# Altium project GPS_Tracking_V1.3.PrjPcb
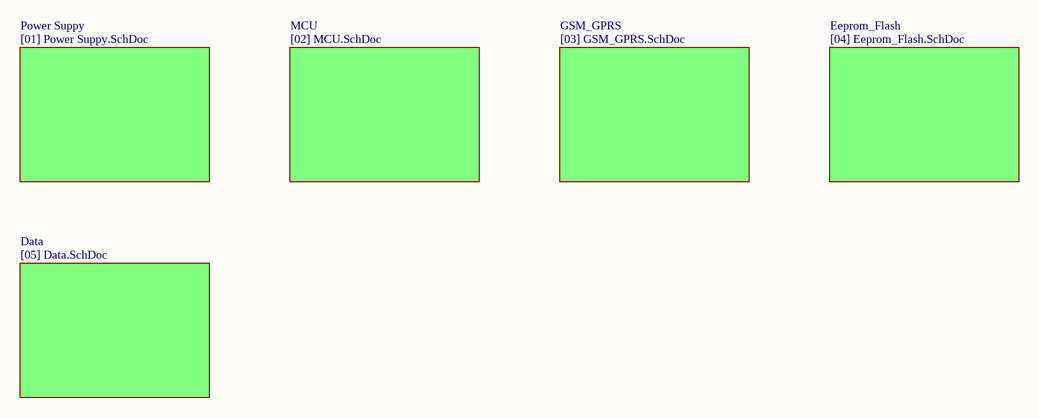
[diagram p0: GPS_Traking_V1_3.SchDoc]
6 sheets, 130 parts. Net scope: flat (ports and power ports of the same name join across sheets).
Board file: GPS_Tracking_V1_3.PcbDoc
Sheets:
  GPS_Traking_V1_3.SchDoc
    Power Suppy = [01] Power Suppy.SchDoc
    MCU = [02] MCU.SchDoc
    GSM_GPRS = [03] GSM_GPRS.SchDoc
    Eeprom_Flash = [04] Eeprom_Flash.SchDoc
    Data = [05] Data.SchDoc

## Sheet GPS_Traking_V1_3.SchDoc: GPS_Tracking
size A4

### Sub-sheets
Data = [05] Data.SchDoc: no entries
Eeprom_Flash = [04] Eeprom_Flash.SchDoc: no entries
GSM_GPRS = [03] GSM_GPRS.SchDoc: no entries
MCU = [02] MCU.SchDoc: no entries
Power Suppy = [01] Power Suppy.SchDoc: no entries

### Notes on the sheet
- Title
- Size:
- Date:
- A4
- Number:
- Time:
- Revision:
- Sheet
- of
- File:

## Sheet [01] Power Suppy.SchDoc: Power Supply
size A4
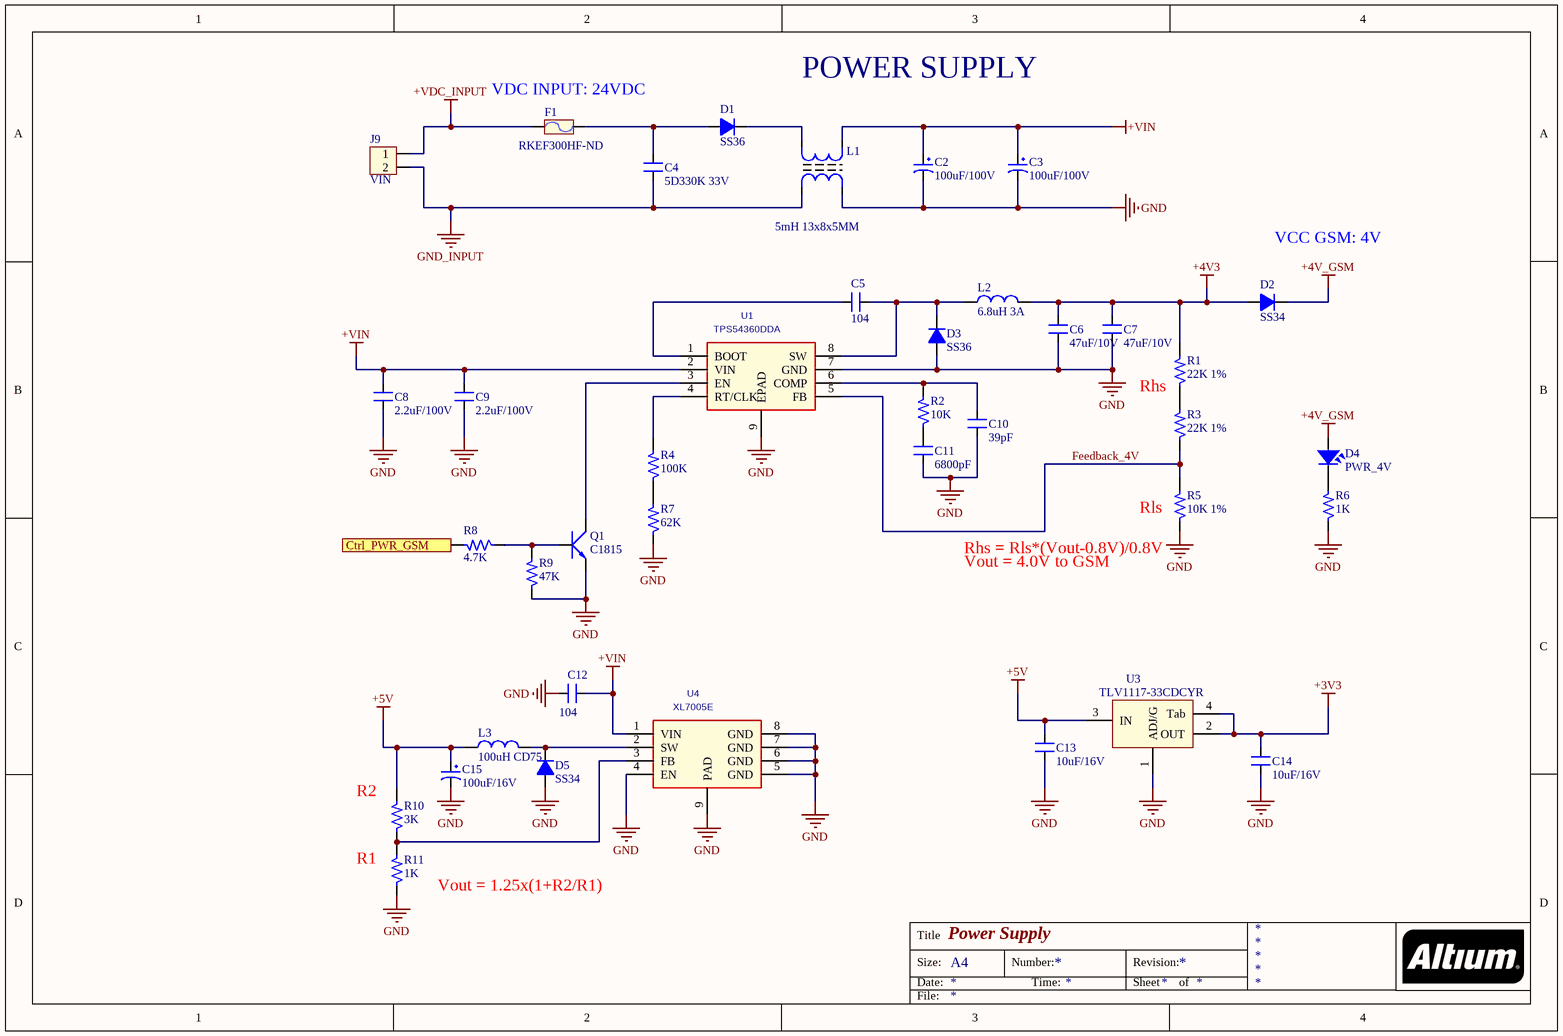
[diagram p1: [01] Power Suppy.SchDoc]

### Parts
C2  100uF/100V  [CP1.5/3.4]
C3  100uF/100V  [CP1.5/3.4]
C4  5D330K 33V  [CN2]
C5  104  [C0603 SMT]
C6  47uF/10V  [SM-1210]
C7  47uF/10V  [SM-1210]
C8  2.2uF/100V  [SM-1210]
C9  2.2uF/100V  [SM-1210]
C10  39pF  [C0603 SMT]
C11  6800pF  [C0603 SMT]
C12  104  [C0603 SMT]
C13  10uF/16V  [C0603 SMT]
C14  10uF/16V  [C0603 SMT]
C15  100uF/16V  [C_Alu_6.3x7.7]
D1  SS36  [DO-214AB SMA]
D2  SS34  [DO-214AB SMA]
D3  SS36  [DO-214AB SMA]
D4  PWR_4V  [Led_0603_Green]
D5  SS34  [DO-214AB SMA]
F1  RKEF300HF-ND  [FUSE2]
J9  VIN  [Hed2V_3.96]
L1  5mH 13x8x5MM  [L2 UF9.8]
L2  6.8uH 3A  [L01 SMD 12*12*6]
L3  100uH CD75  [L01 CD75]
Q1  C1815  [SOT23B]
R1  22K 1%  [R0603 -SMT]
R2  10K  [R0603 -SMT]
R3  22K 1%  [R0603 -SMT]
R4  100K  [R0603 -SMT]
R5  10K 1%  [R0603 -SMT]
R6  1K  [R0603 -SMT]
R7  62K  [R0603 -SMT]
R8  4.7K  [R0603 -SMT]
R9  47K  [R0603 -SMT]
R10  3K  [R0603 -SMT]
R11  1K  [R0603 -SMT]
U1  TPS54360DDA  [DDA8_3P1X2P4-M]
U3  TLV1117-33CDCYR  [SOT223-4N]
U4  XL7005E  [DDA8_3P1X2P4-M]

### Ports
Ctrl_PWR_GSM

### Nets
+3V3: C14.2 U3.2(OUT) U3.4(Tab)
+4V3: C6.2 C7.2 D2.1(A) L2.2 R1.2
+4V_GSM: D2.2(K) D4.1
+5V: C13.2 C15.1 L3.1 R10.2 U3.3(IN)
+VDC_INPUT: F1.1 J9.1
+VIN: C2.1 C3.1 C8.2 C9.2 C12.2 L1.3 U1.2(VIN) U4.1(VIN)
GND: C2.2 C3.2 C6.1 C7.1 C8.1 C9.1 C10.1 C11.1 C12.1 C13.1 C14.1 C15.2 D3.1(A) D5.1(A) L1.2 Q1.1(E) R5.1 R6.1 R7.1 R9.1 R11.1 U1.7(GND) U1.9(EPAD) U3.1(ADJ/G) U4.4(EN) U4.5(GND) U4.6(GND) U4.7(GND) U4.8(GND) U4.9(PAD)
GND_INPUT: C4.1 J9.2 L1.1
Ctrl_PWR_GSM: R8.2 ; port Ctrl_PWR_GSM
Feedback_4V: R3.1 R5.2 U1.5(FB)
NetC4_2: C4.2 D1.1(A) F1.2
NetC5_1: C5.1 U1.1(BOOT)
NetC5_2: C5.2 D3.2(K) L2.1 U1.8(SW)
NetC10_2: C10.2 R2.2 U1.6(COMP)
NetC11_2: C11.2 R2.1
NetD1_2: D1.2(K) L1.4
NetD4_2: D4.2 R6.2
NetD5_2: D5.2(K) L3.2 U4.2(SW)
NetQ1_2: Q1.2(C) U1.3(EN)
NetQ1_3: Q1.3(B) R8.1 R9.2
NetR1_1: R1.1 R3.2
NetR4_1: R4.1 R7.2
NetR4_2: R4.2 U1.4(RT/CLK)
NetR10_1: R10.1 R11.2 U4.3(FB)

### Notes on the sheet
- (near F1) VDC INPUT: 24VDC
- POWER SUPPLY
- VCC GSM: 4V
- Rhs
- (near R5) Rls
- (near R5) Rhs = Rls*(Vout-0.8V)/0.8V
- Vout = 4.0V to GSM
- (near R10) R2
- R1
- Vout = 1.25x(1+R2/R1)
- Title
- Size:
- Date:
- A4
- Number:
- Time:
- Revision:
- Sheet
- of
- File:

### Library data of the parts
C2 C3 = CP4: Cap 1000uF/16V - 220uF/50V; Description 5: 4,7uF>10uF/250V_3,3uF>10uF/400V - 2,2uF>4,7uF/450V; Description 1: 2200uF-3300uF/6,3V - 1000uF-2200uF/10V; Description 2: 1000uF/16V - 470uF => 1000uF/25V - 100uF/100V; Description 3: 330uF>470uF/35V_220uF>470uF/50V_10uF>22uF/250V; Description 4: 220uF => 330uF/63V - 10uF =>33uF/160 - 200V; Value: 1000uF/16V
C4 = CN: Value: 0,1uF/300V; Designed by: VanDungEvn
C5 C10-C14 = CM: Cap SMD; Value: 103
C6 = CM: CAP CER 47UF 10V X5R 1210; Value: 103
C7 = CM: CAP CER 47UF 10V X5R 1210 1276-3380-2-ND; Value: 103
C8 C9 = CM: CAP CER 2.2UF 100V X7R 1210  445-4498-2-ND; Value: 103
C15 = C-Alu-Tantalum: Cap Aluminum, Tantalum 7343; Value: 10uF/50V; Description 1: 10 => 220uF/6,3V/10V - 10uF => 100uF/16V; Description 2: 0,1uF => 33uF/50V - 10uF => 22uF/63V; Description 3: 0,47uF => 10uF/100V
D1 D3 = D5A: DIODE SCHOTTKY 60V 3A SMA; Value: 1N5408
D2 D5 = D1A: DIODE SCHOTTKY 40V 3A SMC; Value: 1N4007
D4 = LED: LED 0603 RED; Value: LED 3 ly Single Colour
F1 = Fuse: PTC RESET FUSE 60V 3A RADIAL; Designed by: VanDungEvn; Value: Fuse
J9 = Hed2: Header 2 (Green); Value: Header 2
L1 = L2x220: Value: Loc 220; Designed by: VanDungEvn
L2 = L1: 6.8uH 3A 12x12x7MM; Value: 150 mH
L3 = L1: Value: 150 mH
Q1 = C1815: NPN 600mW, ECB; Value: C1815
R1-R5 R7-R10 = RM: Resistor SMD; Value: 1K
R6 R11 = RM: Resistor SMD; Value: 1K
U1 = TPS54360DDA: REG BUCK SPLIT RAIL 8SOPWRPAD; C: Copyright (C) 2015 Accelerated Designs. All rights reserved; Vendor: TEXAS INSTRUMENTS; Built_By: EMA_UL_Team; Value: TPS54360DDA; Manufacturer_Part_Number: TPS54360DDA
U3 = LM1117: 3v3; Value: LM317
U4 = XL7005: REG BUCK SPLIT RAIL 8SOPWRPAD; Value: TPS54360DDA; C: Copyright (C) 2015 Accelerated Designs. All rights reserved; Vendor: TEXAS INSTRUMENTS; Built_By: EMA_UL_Team; Manufacturer_Part_Number: TPS54360DDA

## Sheet [02] MCU.SchDoc: MCU
size A4
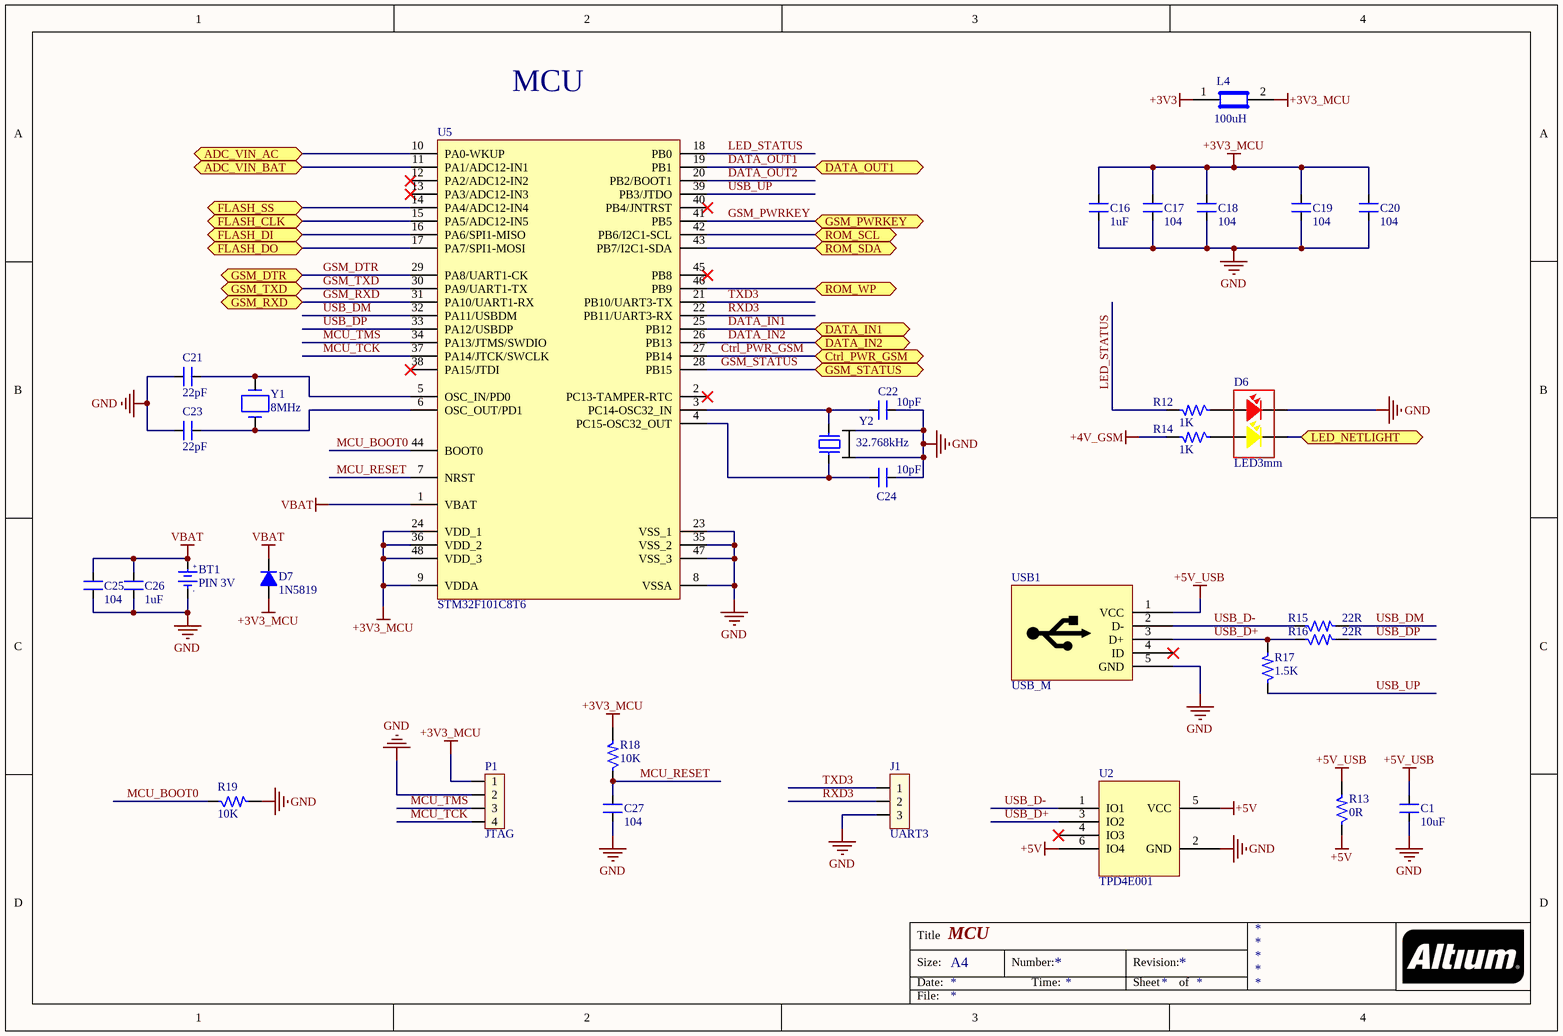
[diagram p2: [02] MCU.SchDoc]

### Parts
BT1  PIN 3V  [CR1220 socket]
C1  10uF  [C0603 SMT]
C16  1uF  [C0603 SMT]
C17  104  [C0603 SMT]
C18  104  [C0603 SMT]
C19  104  [C0603 SMT]
C20  104  [C0603 SMT]
C21  22pF  [C0603 SMT]
C22  10pF  [C0603 SMT]
C23  22pF  [C0603 SMT]
C24  10pF  [C0603 SMT]
C25  104  [C0603 SMT]
C26  1uF  [C0603 SMT]
C27  104  [C0603 SMT]
D6  LED3mm  [LED 2 holder 3mm]
D7  1N5819  [SOD123]
J1  UART3  [JP3]
L4  100uH  [R0805]
P1  JTAG  [JP1x4]
R12  1K  [R0603 -SMT]
R13  0R  [R0805 SMT]
R14  1K  [R0603 -SMT]
R15  22R  [R0603 -SMT]
R16  22R  [R0603 -SMT]
R17  1.5K  [R0603 -SMT]
R18  10K  [R0603 -SMT]
R19  10K  [R0603 -SMT]
U2  TPD4E001  [TPD4E001 DBV]
U5  STM32F101C8T6  [LQFP48-B]
USB1  USB_M  [USB_B_MINI_SMD]
Y1  8MHz  [ABM7_v1_1_BIG]
Y2  32.768kHz  [XT-SMD MC306]

### Ports
ADC_VIN_AC, ADC_VIN_BAT, Ctrl_PWR_GSM, DATA_IN1, DATA_IN2, DATA_OUT1, FLASH_CLK, FLASH_DI, FLASH_DO, FLASH_SS, GSM_DTR, GSM_PWRKEY, GSM_RXD, GSM_STATUS, GSM_TXD, LED_NETLIGHT, ROM_SCL, ROM_SDA, ROM_WP

### Nets
+3V3: L4.1
+3V3_MCU: C16.2 C17.2 C18.2 C19.2 C20.2 D7.1(A) L4.2 P1.1 R18.2 U5.9(VDDA) U5.24(VDD_1) U5.36(VDD_2) U5.48(VDD_3)
+4V_GSM: R14.2
+5V: R13.1 U2.5(VCC) U2.6(IO4)
+5V_USB: C1.2 R13.2 USB1.1(VCC)
GND: BT1.2(GND) C1.1 C16.1 C17.1 C18.1 C19.1 C20.1 C21.2 C22.2 C23.2 C24.2 C25.1 C26.1 C27.2 D6.1 J1.3 P1.2 R19.2 U2.2(GND) U5.8(VSSA) U5.23(VSS_1) U5.35(VSS_2) U5.47(VSS_3) USB1.5(GND) Y2.2 Y2.3
VBAT: BT1.1(+3V) C25.2 C26.2 D7.2(K) U5.1(VBAT)
ADC_VIN_AC: U5.10(PA0-WKUP) ; port ADC_VIN_AC
ADC_VIN_BAT: U5.11(PA1/ADC12-IN1) ; port ADC_VIN_BAT
Ctrl_PWR_GSM: U5.27(PB14) ; port Ctrl_PWR_GSM
DATA_IN1: U5.25(PB12) ; port DATA_IN1
DATA_IN2: U5.26(PB13) ; port DATA_IN2
DATA_OUT1: U5.19(PB1) ; port DATA_OUT1
DATA_OUT2: U5.20(PB2/BOOT1)
FLASH_CLK: U5.15(PA5/ADC12-IN5) ; port FLASH_CLK
FLASH_DI: U5.16(PA6/SPI1-MISO) ; port FLASH_DI
FLASH_DO: U5.17(PA7/SPI1-MOSI) ; port FLASH_DO
FLASH_SS: U5.14(PA4/ADC12-IN4) ; port FLASH_SS
GSM_DTR: U5.29(PA8/UART1-CK) ; port GSM_DTR
GSM_PWRKEY: U5.41(PB5) ; port GSM_PWRKEY
GSM_RXD: U5.31(PA10/UART1-RX) ; port GSM_RXD
GSM_STATUS: U5.28(PB15) ; port GSM_STATUS
GSM_TXD: U5.30(PA9/UART1-TX) ; port GSM_TXD
LED_STATUS: R12.2 U5.18(PB0)
MCU_BOOT0: R19.1 U5.44(BOOT0)
MCU_RESET: C27.1 R18.1 U5.7(NRST)
MCU_TCK: P1.4 U5.37(PA14/JTCK/SWCLK)
MCU_TMS: P1.3 U5.34(PA13/JTMS/SWDIO)
ROM_SCL: U5.42(PB6/I2C1-SCL) ; port ROM_SCL
ROM_SDA: U5.43(PB7/I2C1-SDA) ; port ROM_SDA
ROM_WP: U5.46(PB9) ; port ROM_WP
RXD3: J1.2 U5.22(PB11/UART3-RX)
TXD3: J1.1 U5.21(PB10/UART3-TX)
USB_D+: R16.1 R17.2 U2.3(IO2) USB1.3(D+)
USB_D-: R15.1 U2.1(IO1) USB1.2(D-)
USB_DM: R15.2 U5.32(PA11/USBDM)
USB_DP: R16.2 U5.33(PA12/USBDP)
USB_UP: R17.1 U5.39(PB3/JTDO)
NetC21_1: C21.1 U5.5(OSC_IN/PD0) Y1.1
NetC22_1: C22.1 U5.3(PC14-OSC32_IN) Y2.1
NetC23_1: C23.1 U5.6(OSC_OUT/PD1) Y1.2
NetC24_1: C24.1 U5.4(PC15-OSC32_OUT) Y2.4
NetD6_2: D6.2 R12.1
NetD6_3: D6.3 ; port LED_NETLIGHT
NetD6_4: D6.4 R14.1

Not connected (* = marked no-connect by the designer): U2 4(IO3)*; U5 2(PC13-TAMPER-RTC)* 12(PA2/ADC12-IN2)* 13(PA3/ADC12-IN3)* 38(PA15/JTDI)* 40(PB4/JNTRST)* 45(PB8)*; USB1 4(ID)*

### Notes on the sheet
- MCU
- Title
- Size:
- Date:
- A4
- Number:
- Time:
- Revision:
- Sheet
- of
- File:
- (in symbol PIN 3V) +; -

### Library data of the parts
BT1 = PIN 3V: Battery 3VDC; Value: PIN 3V
C1 C16-C27 = CM: Cap SMD; Value: 103
D6 = LED2Holder_3: LED 2 holder RGB 3mm; Value: LED 3 ly Single Colour
D7 = D1A: Diode 1A; Value: 1N4007
J1 = JP3: Jumper 3; Value: J3
L4 = Ferrite Bead: 100uH 0805
P1 = JP4
R12 R14 = RM: Resistor SMD; Value: 1K
R13 R15-R19 = RM: Resistor SMD; Value: 1K
U5 = STM32F101C8T6: STM32 ARM-based 32-bit MCU with 32 Kbytes Flash, 48-pin LQFP, Industrial Temperature
Y1 = ABM7-16.000MHZ-D2Y-T: CRYSTAL 16MHZ 18PF SMD; Manufacturer: Abracon LLC; Frequency Stability: ±30ppm; Frequency Tolerance: ±20ppm; ESR (Equivalent Series Resistance): 50 Ohm; Operating Mode: Fundamental; .Creator: MM; .Checked PCB: RF; Supplier 1: Digi-Key; Manufacturer Part Number: ABM7-16.000MHZ-D2Y-T; RoHS: RoHS Compliant; Category: Crystals and Oscillators; Stock 1: 5861; Pricing 1: 1=0.96, 10=0.847, 50=0.791, 100=0.7, 500=0.6615 (USD); Packaging: Cut Tape (CT); Type: MHz Crystal; Frequency: 16MHz; Load Capacitance: 18pF; Operating Temperature: -40°C ~ 85°C; Ratings: -; Mounting Type: Surface Mount; Package / Case: 2-SMD; Size / Dimension: 0.236" L x 0.138" W (6.00mm x 3.50mm); Height: 0.055" (1.40mm); ComponentLink1URL: http://www.abracon.com/Resonators/abm7.pdf; ComponentLink1Description: http://www.abracon.com/Resonators/abm7.pdf; Supplier Part Number 1: 535-9840-1-ND; .Checked SCH: RF
Y2 = XT4_SMD_MC306: Crystal SMD 6035 - 4 Pads; Value: 4Mhz

## Sheet [03] GSM_GPRS.SchDoc: GSM_GPRS
size A4
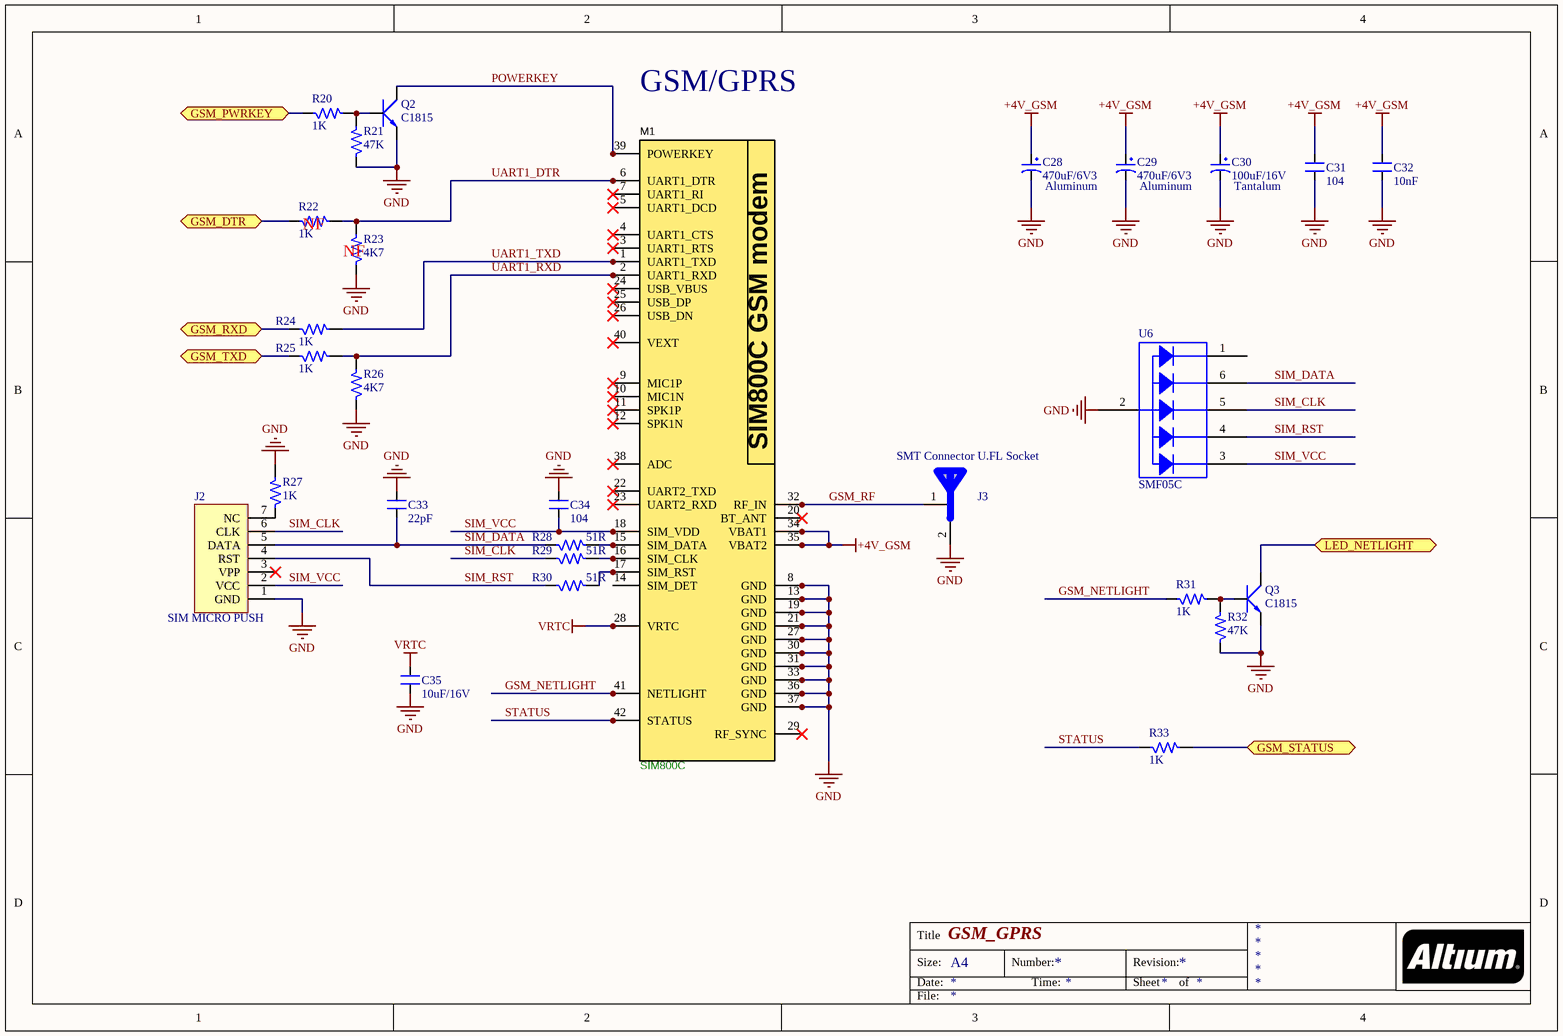
[diagram p3: [03] GSM_GPRS.SchDoc]

### Parts
C28  470uF/6V3  [C_Alu_6.3x7.7]
C29  470uF/6V3  [C_Alu_6.3x7.7]
C30  100uF/16V  [C_7343_40]
C31  104  [C0603 SMT]
C32  10nF  [C0603 SMT]
C33  22pF  [C0603 SMT]
C34  104  [C0603 SMT]
C35  10uF/16V  [C0603 SMT]
J2  SIM MICRO PUSH  [MicroSim 6P]
J3  SMT Connector U.FL Socket  [Antenna-IPEX]
M1  SIM800C  [SIM800C]
Q2  C1815  [SOT23B]
Q3  C1815  [SOT23B]
R20  1K  [R0603 -SMT]
R21  47K  [R0603 -SMT]
R22  1K  [R0603 -SMT]
R23  4K7  [R0603 -SMT]
R24  1K  [R0603 -SMT]
R25  1K  [R0603 -SMT]
R26  4K7  [R0603 -SMT]
R27  1K  [R0805 SMT]
R28  51R  [R0603 -SMT]
R29  51R  [R0603 -SMT]
R30  51R  [R0603 -SMT]
R31  1K  [R0603 -SMT]
R32  47K  [R0603 -SMT]
R33  1K  [R0603 -SMT]
U6  SMF05C  [SOT_363_6]

### Ports
GSM_DTR, GSM_PWRKEY, GSM_RXD, GSM_STATUS, GSM_TXD, LED_NETLIGHT

### Nets
+4V_GSM: C28.1 C29.1 C30.1 C31.1 C32.1 M1.34(VBAT1) M1.35(VBAT2)
GND: C28.2 C29.2 C30.2 C31.2 C32.2 C33.2 C34.2 C35.2 J2.1(GND) J3.2(GND) M1.8(GND) M1.13(GND) M1.19(GND) M1.21(GND) M1.27(GND) M1.30(GND) M1.31(GND) M1.33(GND) M1.36(GND) M1.37(GND) Q2.1(E) Q3.1(E) R21.1 R23.1 R26.1 R27.2 R32.1 U6.2(A)
VRTC: C35.1 M1.28(VRTC)
GSM_DTR: R22.1 ; port GSM_DTR
GSM_NETLIGHT: M1.41(NETLIGHT) R31.1
GSM_PWRKEY: R20.1 ; port GSM_PWRKEY
GSM_RF: J3.1(GND) M1.32(RF_IN)
GSM_RXD: R24.1 ; port GSM_RXD
GSM_STATUS: R33.2 ; port GSM_STATUS
GSM_TXD: R25.1 ; port GSM_TXD
POWERKEY: M1.39(POWERKEY) Q2.2(C)
SIM_CLK: J2.6(CLK) R29.1 U6.5(K4)
SIM_DATA: C33.1 J2.5(DATA) R28.1 U6.6(K5)
SIM_RST: J2.4(RST) R30.1 U6.4(K3)
SIM_VCC: C34.1 J2.2(VCC) M1.18(SIM_VDD) U6.3(K2)
STATUS: M1.42(STATUS) R33.1
UART1_DTR: M1.6(UART1_DTR) R22.2 R23.2
UART1_RXD: M1.2(UART1_RXD) R25.2 R26.2
UART1_TXD: M1.1(UART1_TXD) R24.2
NetD6_3: Q3.2(C) ; port LED_NETLIGHT
NetJ2_7: J2.7(NC) R27.1
NetM1_15: M1.15(SIM_DATA) R28.2
NetM1_16: M1.16(SIM_CLK) R29.2
NetM1_17: M1.17(SIM_RST) R30.2
NetQ2_3: Q2.3(B) R20.2 R21.2
NetQ3_3: Q3.3(B) R31.2 R32.2

Not connected (* = marked no-connect by the designer): J2 3(VPP)*; M1 3(UART1_RTS)* 4(UART1_CTS)* 5(UART1_DCD)* 7(UART1_RI)* 9(MIC1P)* 10(MIC1N)* 11(SPK1P)* 12(SPK1N)* 14(SIM_DET) 20(BT_ANT)* 22(UART2_TXD)* 23(UART2_RXD)* 24(USB_VBUS)* 25(USB_DP)* 26(USB_DN)* 29(RF_SYNC)* 38(ADC)* 40(VEXT)*; U6 1(K1)

### Notes on the sheet
- GSM/GPRS
- (near R22) NF
- (near C28) Aluminum
- (near C29) Aluminum
- (near C30) Tantalum
- (near R23) NF
- Title
- Size:
- Date:
- A4
- Number:
- Time:
- Revision:
- Sheet
- of
- File:
- (in symbol SIM800C) SIM800C GSM modem

### Library data of the parts
C28 C29 = C-Alu-Tantalum: Cap Aluminum; Value: 10uF/50V; Description 1: 10 => 220uF/6,3V/10V - 10uF => 100uF/16V; Description 2: 0,1uF => 33uF/50V - 10uF => 22uF/63V; Description 3: 0,47uF => 10uF/100V
C30 = C-Alu-Tantalum: Cap Tantalum 7343; Value: 10uF/50V; Description 1: 10 => 220uF/6,3V/10V - 10uF => 100uF/16V; Description 2: 0,1uF => 33uF/50V - 10uF => 22uF/63V; Description 3: 0,47uF => 10uF/100V
C31-C35 = CM: Cap SMD; Value: 103
J3 = ANTEN
Q2 Q3 = C1815: NPN 600mW, ECB; Value: C1815
R20 R22 R24 R25 R27 R31 R33 = RM: Resistor SMD; Value: 1K
R21 R23 R26 R28-R30 R32 = RM: Resistor SMD; Value: 1K
U6 = SMF05C: ESD Protection

## Sheet [04] Eeprom_Flash.SchDoc: EEPROM_FLASH
size A4
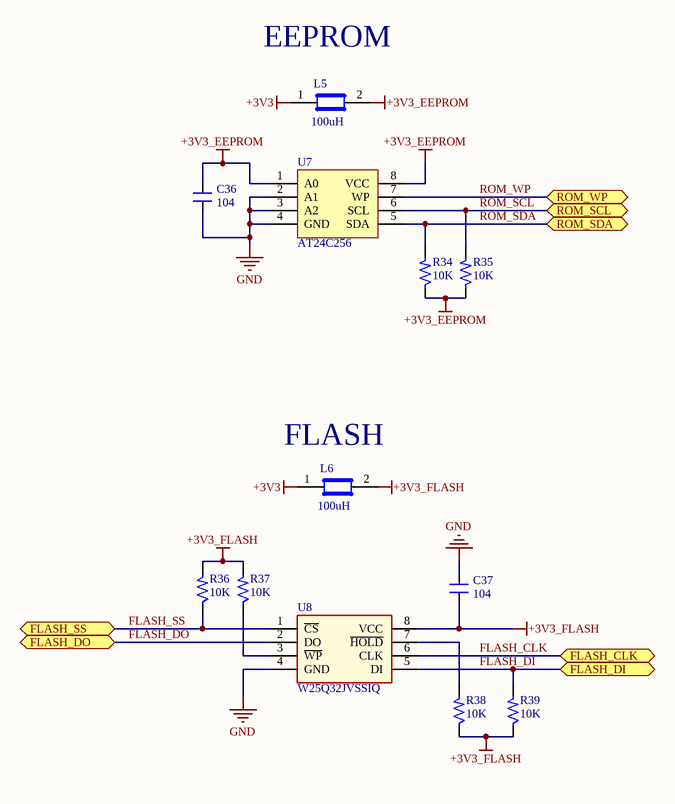
[diagram p4: [04] Eeprom_Flash.SchDoc]

### Parts
C36  104  [C0603 SMT]
C37  104  [C0603 SMT]
L5  100uH  [R0805]
L6  100uH  [R0805]
R34  10K  [R0603 -SMT]
R35  10K  [R0603 -SMT]
R36  10K  [R0603 -SMT]
R37  10K  [R0603 -SMT]
R38  10K  [R0603 -SMT]
R39  10K  [R0603 -SMT]
U7  AT24C256  [SO-8]
U8  W25Q32JVSSIQ  [SO-8 208]

### Ports
FLASH_CLK, FLASH_DI, FLASH_DO, FLASH_SS, ROM_SCL, ROM_SDA, ROM_WP

### Nets
+3V3: L5.1 L6.1
+3V3_EEPROM: C36.2 L5.2 R34.1 R35.1 U7.1(A0) U7.8(VCC)
+3V3_FLASH: C37.1 L6.2 R36.2 R37.2 R38.1 R39.1 U8.8(VCC)
GND: C36.1 C37.2 U7.2(A1) U7.3(A2) U7.4(GND) U8.4(GND)
FLASH_CLK: U8.6(CLK) ; port FLASH_CLK
FLASH_DI: R39.2 U8.5(DI) ; port FLASH_DI
FLASH_DO: U8.2(DO) ; port FLASH_DO
FLASH_SS: R36.1 U8.1(~{CS}) ; port FLASH_SS
ROM_SCL: R35.2 U7.6(SCL) ; port ROM_SCL
ROM_SDA: R34.2 U7.5(SDA) ; port ROM_SDA
ROM_WP: U7.7(WP) ; port ROM_WP
NetR37_1: R37.1 U8.3(~{WP})
NetR38_2: R38.2 U8.7(~{HOLD})

### Notes on the sheet
- (near L5) EEPROM
- (near L6) FLASH
- Title
- Size:
- Date:
- A4
- Number:
- Time:
- Revision:
- Sheet
- of
- File:

### Library data of the parts
C36 C37 = CM: Cap SMD; Value: 103
L5 L6 = Ferrite Bead: 100uH 0805
R34-R39 = RM: Resistor SMD; Value: 1K
U7 = AT24Cxx
U8 = W25Q32JV: FLASH 32MBIT 133MHZ 8SOP

## Sheet [05] Data.SchDoc: DATA
size A4
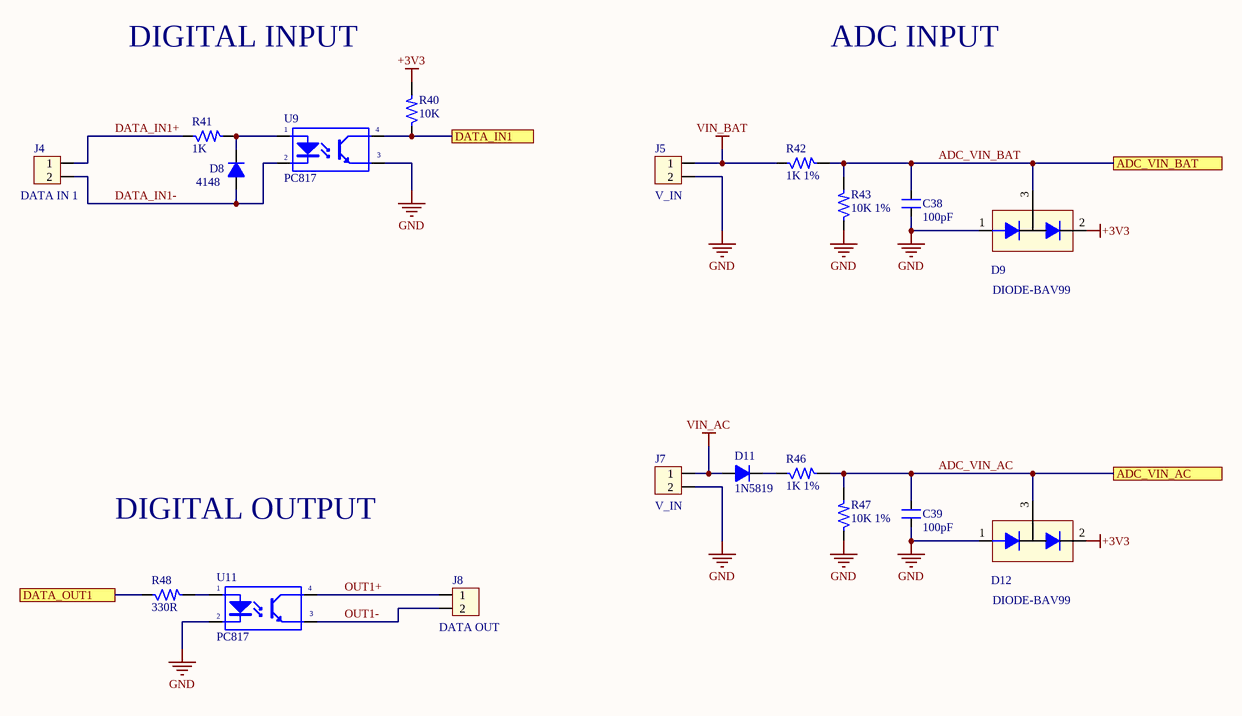
[diagram p5: [05] Data.SchDoc]

### Parts
C38  100pF  [C0603 SMT]
C39  100pF  [C0603 SMT]
D8  4148  [DO-4148 SMD]
D9  DIODE-BAV99  [SOT23]
D11  1N5819  [SOD123]
D12  DIODE-BAV99  [SOT23]
J4  DATA IN 1  [CON_2.54mm_2]
J5  V_IN  [CON_2.54mm_2]
J7  V_IN  [CON_2.54mm_2]
J8  DATA OUT  [CON_2.54mm_2]
R40  10K  [R0603 -SMT]
R41  1K  [R0603 -SMT]
R42  1K 1%  [R0603 -SMT]
R43  10K 1%  [R0603 -SMT]
R46  1K 1%  [R0603 -SMT]
R47  10K 1%  [R0603 -SMT]
R48  330R  [R0603 -SMT]
U9  PC817  [SOP-4-B]
U11  PC817  [SOP-4-B]

### Ports
ADC_VIN_AC, ADC_VIN_BAT, DATA_IN1, DATA_OUT1

### Nets
+3V3: D9.2 D12.2 R40.2
GND: C38.1 C39.1 D9.1 D12.1 J5.2 J7.2 R43.1 R47.1 U9.3(E) U11.2(K)
VIN_AC: D11.1(A) J7.1
VIN_BAT: J5.1 R42.1
ADC_VIN_AC: C39.2 D12.3 R46.2 R47.2 ; port ADC_VIN_AC
ADC_VIN_BAT: C38.2 D9.3 R42.2 R43.2 ; port ADC_VIN_BAT
DATA_IN1: R40.1 U9.4(C) ; port DATA_IN1
DATA_IN1+: J4.1 R41.1
DATA_IN1-: D8.1(A) J4.2 U9.2(K)
DATA_OUT1: R48.1 ; port DATA_OUT1
OUT1+: J8.1 U11.4(C)
OUT1-: J8.2 U11.3(E)
NetD8_2: D8.2(K) R41.2 U9.1(A)
NetD11_2: D11.2(K) R46.1
NetR48_2: R48.2 U11.1(A)

### Notes on the sheet
- DIGITAL INPUT
- ADC INPUT
- DIGITAL OUTPUT
- Title
- Size:
- Date:
- A4
- Number:
- Time:
- Revision:
- Sheet
- of
- File:

### Library data of the parts
C38 C39 = CM: Cap SMD; Value: 103
D8 D11 = D1A: Diode 1A; Value: 1N4007
D9 D12 = DIODE-BAV99: ZENER, SOT23,; Manufacturer: ON Semiconductor / Fairchild; Manufacturer Part Number: BAV99; .Creator: LeKhaLinh; Other Drawings: Diode Circuit; PCN Design/Specification: Mold Compound 12/Dec/2007; PCN Assembly/Origin: SOT23 Manufacturing Source 31/May2013 / Assembly Site Addition 20/Jul/2015; PCN Packaging: Binary Year Code Marking 15/Jan/2014; Diode Configuration: 1 Pair Series Connection; Diode Type: Standard; Voltage - DC Reverse (Vr) (Max): 70V; Current - Average Rectified (Io) (per Diode): 200mA; Voltage - Forward (Vf) (Max) @ If: 1.25V @ 150mA; Speed: Small Signal =; Reverse Recovery Time (trr): 6ns; Current - Reverse Leakage @ Vr: 2.5µA @ 70V; Online Catalog: Diode Array; Other Names: BAV99FSDKR; .CheckPCB: LeKhaLinh; .CheckSCH: LeKhaLinh; Supplier 1: Digi-Key; Stock 1: 1165; Pricing 1: 1=0.26, 10=0.21, 100=0.1115, 500=0.0734, 1000=0.0499 (USD); Standard Package: 1; Category: Discrete Semiconductor Products; Family: Diodes, Rectifiers - Arrays; Packaging: Digi-Reel®; Mounting Type: Surface Mount; Package / Case: TO-236-3, SC-59, SOT-23-3; Supplier Device Package: SOT-23-3 (TO-236); ComponentLink1URL: https://www.fairchildsemi.com/package-drawings/MA/MA03B.pdf?src-supplier=Digi-Key; ComponentLink1Description: https://www.fairchildsemi.com/package-drawings/MA/MA03B.pdf?src-supplier=Digi-Key; ComponentLink2URL: http://www.farnell.com/datasheets/1822674.pdf?src-supplier=Element14; ComponentLink2Description: http://www.farnell.com/datasheets/1822674.pdf?src-supplier=Element14; ComponentLink3URL: http://www.mouser.com/ds/2/149/BAV99-22788.pdf?src-supplier=Mouser; ComponentLink3Description: http://www.mouser.com/ds/2/149/BAV99-22788.pdf?src-supplier=Mouser; ComponentLink4URL: http://www.fairchildsemi.com/ds/BA/BAV99.pdf?src-supplier=Avnet+Europe; ComponentLink4Description: http://www.fairchildsemi.com/ds/BA/BAV99.pdf?src-supplier=Avnet+Europe; ComponentLink5URL: https://www.verical.com/server-webapp/html/getDatasheet?partID=110217&src-supplier=Verical; ComponentLink5Description: https://www.verical.com/server-webapp/html/getDatasheet?partID=110217&src-supplier=Verical; ComponentLink6URL: http://www.farnell.com/datasheets/2304409.pdf?src-supplier=Element14; ComponentLink6Description: http://www.farnell.com/datasheets/2304409.pdf?src-supplier=Element14; Supplier 2: Mouser; Stock 2: 0; Supplier 3: Arrow; Stock 3: 5700; Pricing 3: 1=0.1933, 10=0.1873, 25=0.1555, 100=0.0806, 250=0.0724, 500=0.0523, 1000=0.0428, 3000=0.0342 (USD); Supplier Part Number 1: BAV99FSCT-ND; Supplier Part Number 2: 512-BAV99; Supplier Part Number 3: BAV99
J4 J5 J7 J8 = Con2: Connector 2; Value: Connector 2
R40 R43 R47 R48 = RM: Resistor SMD; Value: 1K
R41 R42 R46 = RM: Resistor SMD; Value: 1K
U9 U11 = PC817: Single Opto; Value: PC817

## Nets that join several sheets
+3V3: [01] Power Suppy (C14.2 U3.2 U3.4), [02] MCU (L4.1), [04] Eeprom_Flash (L5.1 L6.1), [05] Data (D9.2 D12.2 R40.2)
+4V_GSM: [01] Power Suppy (D2.2 D4.1), [02] MCU (R14.2), [03] GSM_GPRS (7 pins)
+5V: [01] Power Suppy (5 pins), [02] MCU (R13.1 U2.5 U2.6)
GND: [01] Power Suppy (30 pins), [02] MCU (26 pins), [03] GSM_GPRS (28 pins), [04] Eeprom_Flash (6 pins), [05] Data (10 pins)
ADC_VIN_AC: [02] MCU (U5.10), [05] Data (C39.2 D12.3 R46.2 R47.2)
ADC_VIN_BAT: [02] MCU (U5.11), [05] Data (C38.2 D9.3 R42.2 R43.2)
Ctrl_PWR_GSM: [01] Power Suppy (R8.2), [02] MCU (U5.27)
DATA_IN1: [02] MCU (U5.25), [05] Data (R40.1 U9.4)
DATA_OUT1: [02] MCU (U5.19), [05] Data (R48.1)
FLASH_CLK: [02] MCU (U5.15), [04] Eeprom_Flash (U8.6)
FLASH_DI: [02] MCU (U5.16), [04] Eeprom_Flash (R39.2 U8.5)
FLASH_DO: [02] MCU (U5.17), [04] Eeprom_Flash (U8.2)
FLASH_SS: [02] MCU (U5.14), [04] Eeprom_Flash (R36.1 U8.1)
GSM_DTR: [02] MCU (U5.29), [03] GSM_GPRS (R22.1)
GSM_PWRKEY: [02] MCU (U5.41), [03] GSM_GPRS (R20.1)
GSM_RXD: [02] MCU (U5.31), [03] GSM_GPRS (R24.1)
GSM_STATUS: [02] MCU (U5.28), [03] GSM_GPRS (R33.2)
GSM_TXD: [02] MCU (U5.30), [03] GSM_GPRS (R25.1)
NetD6_3: [02] MCU (D6.3), [03] GSM_GPRS (Q3.2)
ROM_SCL: [02] MCU (U5.42), [04] Eeprom_Flash (R35.2 U7.6)
ROM_SDA: [02] MCU (U5.43), [04] Eeprom_Flash (R34.2 U7.5)
ROM_WP: [02] MCU (U5.46), [04] Eeprom_Flash (U7.7)